# EAGLE design single_key_module (EAGLE 9.5.1)
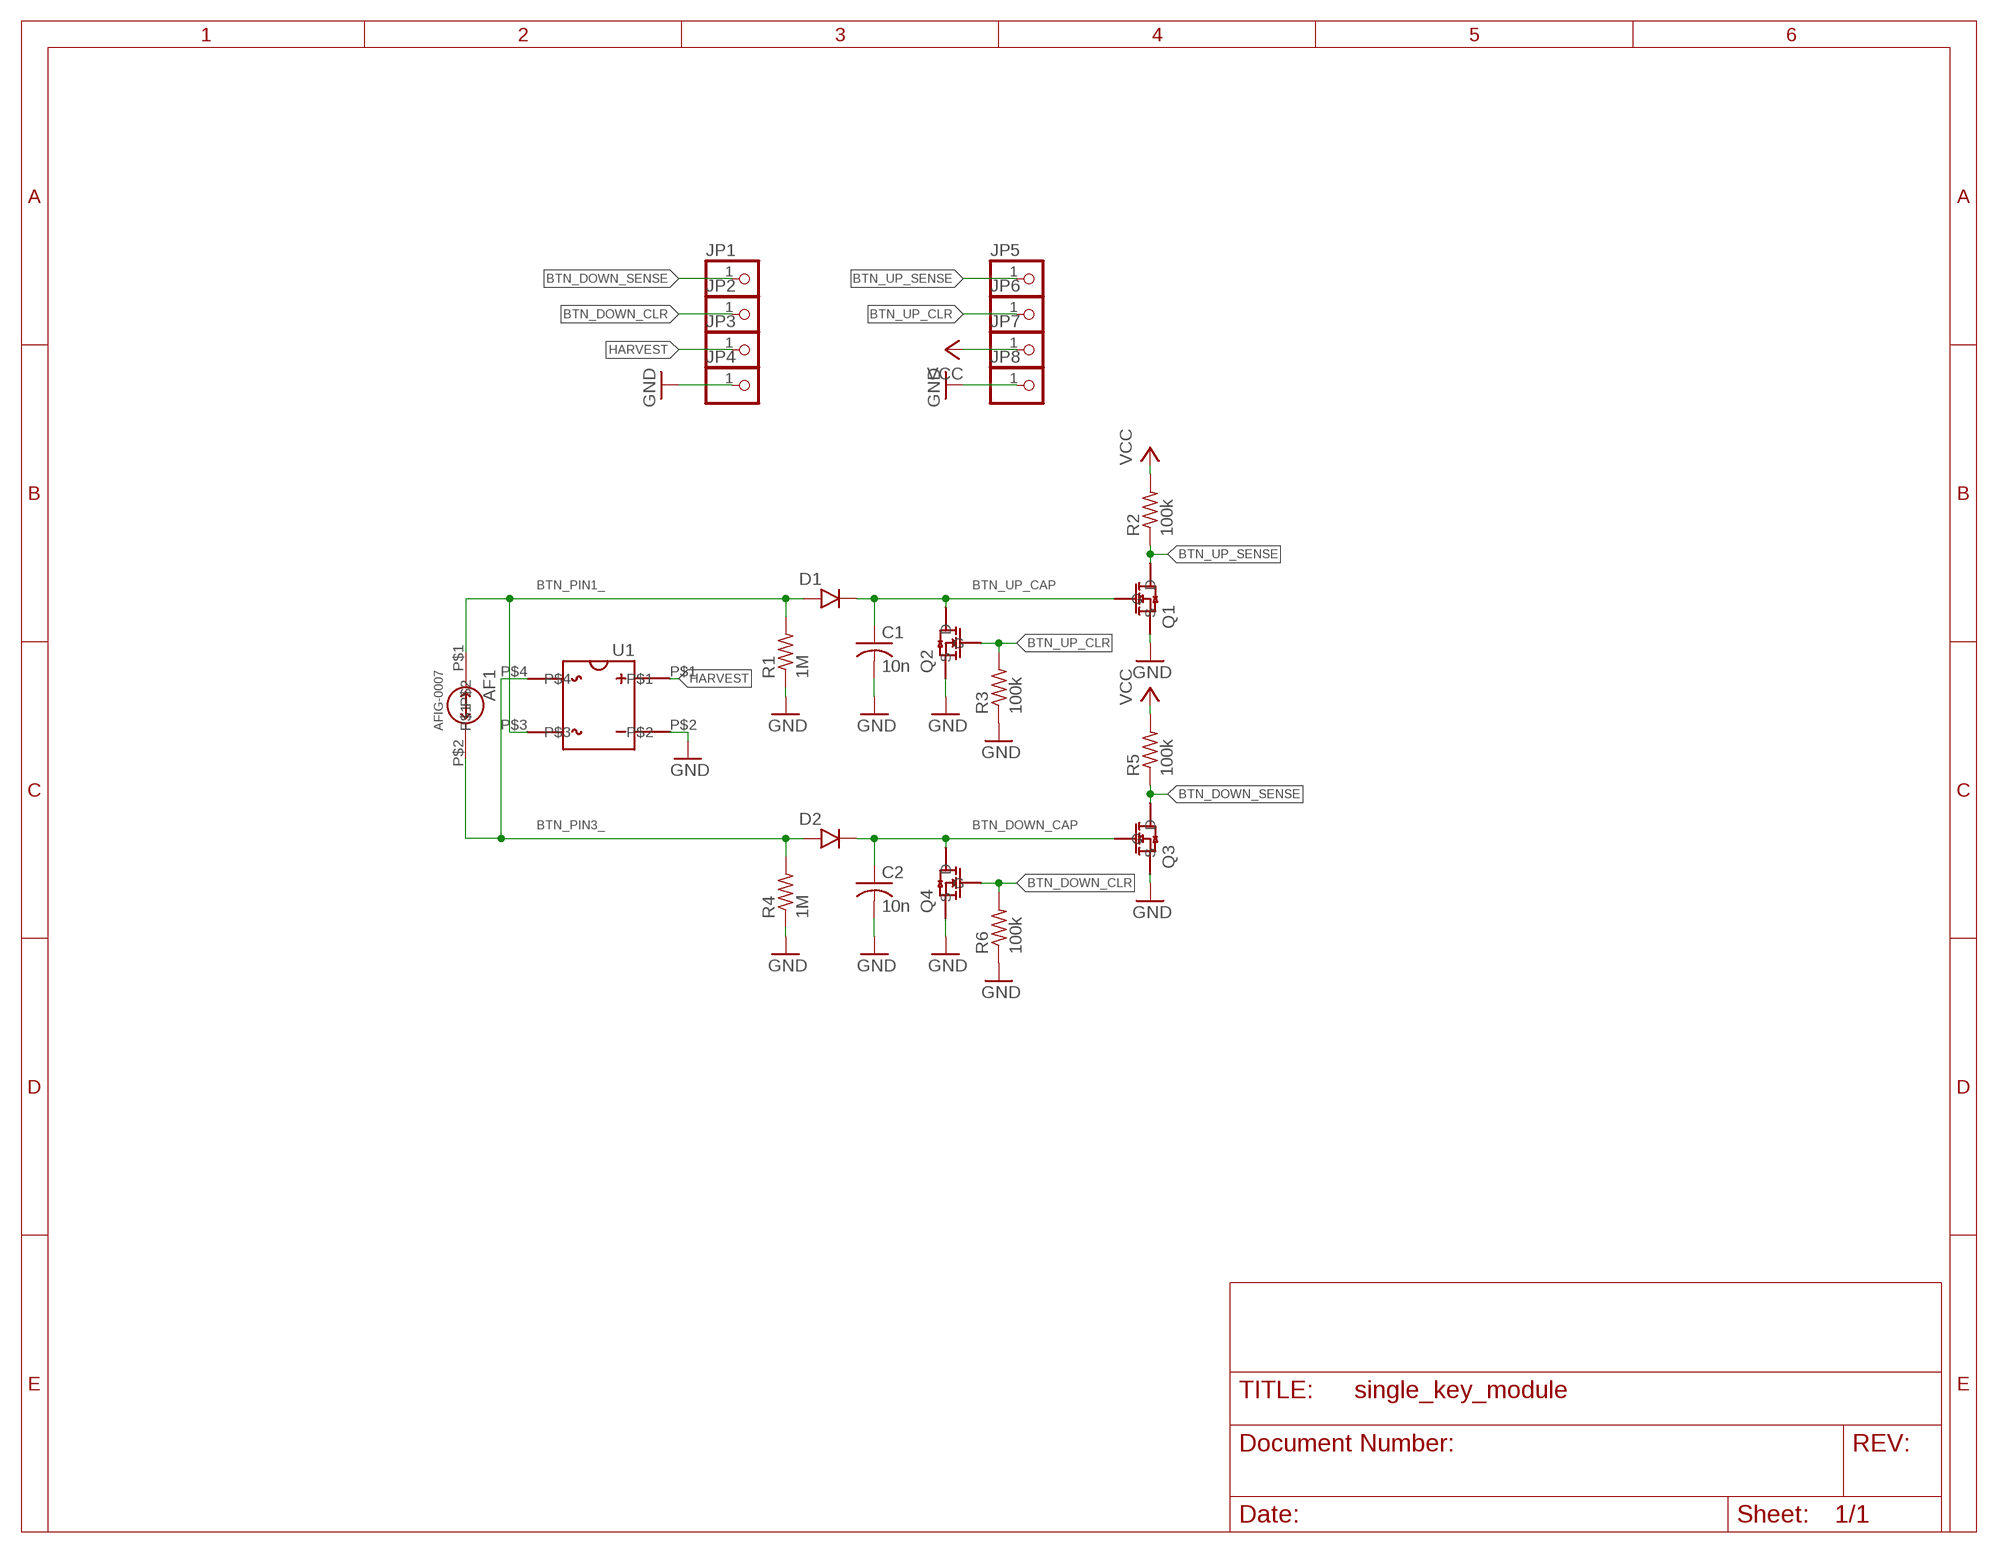
[diagram p0: schematic, sheet 1]

## Parts
AF1  BUTTON-MOUNT  [BUTTON-MOUNT]
C1  10n  C-USC0402  [C0402]
C2  10n  C-USC0402  [C0402]
D1  DFLU1200  [DFLU1200]
D2  DFLU1200  [DFLU1200]
JP1  PINHD-1X1  [1X01]
JP2  PINHD-1X1  [1X01]
JP3  PINHD-1X1  [1X01]
JP4  PINHD-1X1  [1X01]
JP5  PINHD-1X1  [1X01]
JP6  PINHD-1X1  [1X01]
JP7  PINHD-1X1  [1X01]
JP8  PINHD-1X1  [1X01]
Q1  2N7002K-7  [2N7002K-7]
Q2  BSS138K  [BSS138K]
Q3  2N7002K-7  [2N7002K-7]
Q4  BSS138K  [BSS138K]
R1  1M  R-US_R0402  [R0402]
R2  100k  R-US_R0402  [R0402]
R3  100k  R-US_R0402  [R0402]
R4  1M  R-US_R0402  [R0402]
R5  100k  R-US_R0402  [R0402]
R6  100k  R-US_R0402  [R0402]
U1  CDBHD140L-G  [CDBHDXX0L-G]

## Nets
BTN_DOWN_CAP: C2.1 D2.K Q3.G Q4.D
BTN_DOWN_CLR: JP2.1 Q4.G R6.2
BTN_DOWN_SENSE: JP1.1 Q3.D R5.1
BTN_PIN1_: AF1.P$1 D1.A R1.2 U1.P$3
BTN_PIN3_: AF1.P$2 D2.A R4.2 U1.P$4
BTN_UP_CAP: C1.1 D1.K Q1.G Q2.D
BTN_UP_CLR: JP6.1 Q2.G R3.2
BTN_UP_SENSE: JP5.1 Q1.D R2.1
GND: C1.2 C2.2 JP4.1 JP8.1 Q1.S Q2.S Q3.S Q4.S R1.1 R3.1 R4.1 R6.1 U1.P$2
HARVEST: JP3.1 U1.P$1
VCC: JP7.1 R2.2 R5.2

## Library data of the parts
AF1 = afig-0007:BUTTON-MOUNT
C1 C2 = rcl:C-US: CAPACITOR, American symbol; SPICEPREFIX: C
D1 D2 = afig-0007:DFLU1200
JP1-JP8 = pinhead:PINHD-1X1: PIN HEADER
Q1 Q3 = afig-0007:2N7002K-7
Q2 Q4 = afig-0007:BSS138K
R1-R6 = rcl:R-US_: RESISTOR, American symbol; SPICEPREFIX: R
U1 = afig-0007:CDBHD140L-G

## Board
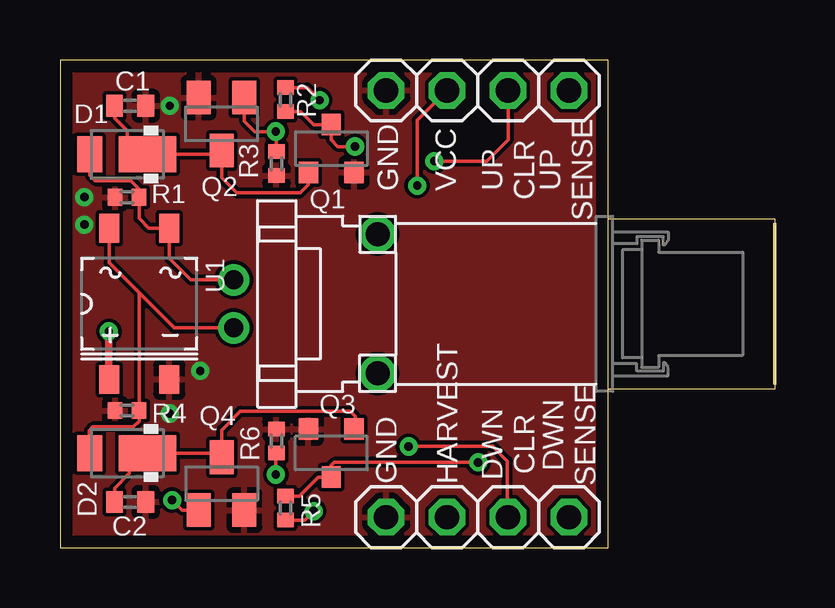
[diagram p1: board, top side]
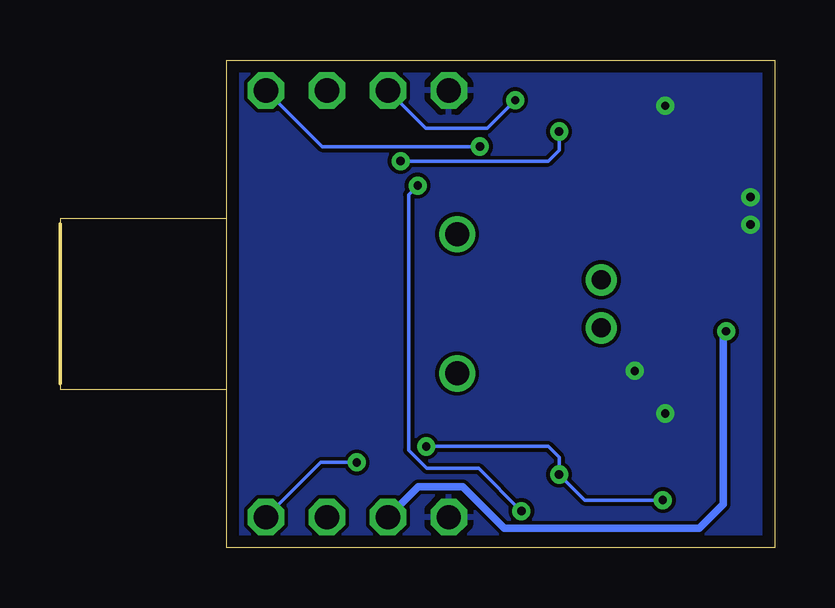
[diagram p2: board, bottom side, seen from below]

Size 22.84 x 20.32 mm. Coordinates in mm from the lower left corner, seen from the top.
Outline: 0,0 22.84,0 22.84,20.32 0,20.32 0,0
Copper layers (1*16): Top 0.035mm / dielectric 1.5mm / Bottom 0.035mm
Design rules "default *": minimum track width 6mil, minimum drill 0.35mm, track to track 6mil, track to pad 6mil, pad to pad 6mil, via to via 6mil, smd to smd 6mil, copper to edge 20mil, drill to drill 6mil, minimum pad ring 10mil, minimum via ring 8mil, stop-mask expansion 4mil, vias tented up to drill 15mil, thermal gap 10mil

### Footprints (pad centres in the part's own frame; a part is rotated, then mirrored left to right if it is on the bottom)
BUTTON-MOUNT = drill 0.8: P$1 0,1; P$2 0,-1 | drill 1: P$3 6,-2.9; P$4 6,2.9
C0402 = smd 0.7 x 0.9: 1 -0.65,0; 2 0.65,0
DFLU1200 = smd 1.05 x 1.5: A -1.55,0 | smd 2.4 x 1.5: K 0.85,0
1X01 = drill 1.016 octagon: 1 0,0
2N7002K-7 = smd 0.8 x 0.9: D 0,1; G -0.95,-1; S 0.95,-1
BSS138K = smd 1 x 1.4: D 0,1.1; G -0.95,-1.1; S 0.95,-1.1
R0402 = smd 0.6 x 0.7: 1 -0.5,0; 2 0.5,0
CDBHDXX0L-G = smd 0.85 x 1.2: P$1 1.25,3.15; P$2 -1.25,3.15; P$3 -1.25,-3.15; P$4 1.25,-3.15

### Placement (x,y rotation side)
AF1  7.24,10.16 0 top
C1  2.92,18.41 0 top
C2  2.92,1.91 0 top
D1  2.79,16.38 0 top
D2  2.79,3.94 0 top
JP1  21.21,1.27 0 top
JP2  18.67,1.27 0 top
JP3  16.13,1.27 0 top
JP4  13.59,1.27 0 top
JP5  21.21,19.05 0 top
JP6  18.67,19.05 0 top
JP7  16.13,19.05 0 top
JP8  13.59,19.05 0 top
Q1  11.3,16.64 0 top
Q2  6.73,17.65 180 top
Q3  11.3,3.94 180 top
Q4  6.73,2.67 0 top
R1  2.79,14.61 0 top
R2  9.4,18.67 90 top
R3  9.02,16 90 top
R4  2.79,5.71 0 top
R5  9.4,1.65 270 top
R6  9.02,4.45 270 top
U1  3.3,10.16 180 top

### Tracks (layer width: path | path; a pad name or v marks a point on that pad's centre or on a via)
BTN_DOWN_CAP
  Top 0.152: C2.1 2.27,2.47 2.9,3.1 2.9,3.86 2.97,3.94 D2.K 6.56,3.94 Q4.D 6.73,4.9 7.52,5.69 12.09,5.69 12.29,5.49 12.29,4.98 Q3.G
BTN_DOWN_CLR  (via drill 0.35)
  Top 0.152: JP2.1 18.64,1.29 18.64,3.61 18.03,4.22 v14.53,4.22 | v8.99,3.05 8.99,3.92 R6.2 | v4.67,1.98 5.09,1.57 Q4.G
  Bottom 0.152: v14.53,4.22 9.45,4.22 8.99,3.76 v8.99,3.05 7.92,1.98 v4.67,1.98
BTN_DOWN_SENSE  (via drill 0.35)
  Top 0.152: v17.42,3.56 11.43,3.56 11.3,3.43 Q3.D 10.76,2.94 9.97,2.15 R5.1
  Bottom 0.152: JP1.1 18.92,3.56 v17.42,3.56
BTN_PIN1_
  Top 0.152: AF1.P$1 5.45,11.16 4.55,12.06 U1.P$3 3.71,13.31 3.29,13.72 R1.2 3.29,14.94 2.95,15.29 1.47,15.29 1.24,15.52 D1.A
BTN_PIN3_
  Top 0.152: U1.P$4 2.05,11.87 3.29,10.62 | AF1.P$2 4.76,9.16 3.29,10.62 | 3.29,10.62 R4.2 3.29,5.28 3.05,5.03 1.37,5.03 1.22,4.88 1.22,3.96 D2.A
BTN_UP_CAP
  Top 0.152: Q1.G 10.35,15.13 10.01,14.78 7.37,14.78 6.73,15.42 Q2.D 6.56,16.38 D1.K 3.23,16.38 2.79,16.82 2.79,17.37 2.27,17.9 C1.1
BTN_UP_CLR  (via drill 0.35)
  Top 0.152: JP6.1 18.67,16.99 17.78,16.1 v15.6,16.1 v15.6,16.11 | R3.2 9.02,17.31 v8.99,17.34 8.11,17.34 7.68,17.77 Q2.G
  Bottom 0.152: v15.6,16.11 9.45,16.11 8.99,16.56 v8.99,17.34
BTN_UP_SENSE  (via drill 0.35)
  Top 0.152: v12.29,16.71 11.58,16.71 11.3,16.99 11.3,17.63 | 11.3,17.63 Q1.D | R2.1 10.03,18.17 10.57,17.63 11.3,17.63
  Bottom 0.152: JP5.1 18.87,16.71 v12.29,16.71
GND  (via drill 0.35)
  other vias: 1.02,14.61 1.02,13.46 4.57,18.41 5.84,7.37 4.57,5.59
  pour Top: -0.89,-1.27 24.38,-1.27 24.38,21.59 -0.89,21.59
  pour Bottom: -2.03,-2.54 25.65,-2.54 25.65,22.86 -2.03,22.86
HARVEST  (via drill 0.35)
  Top 0.305: U1.P$1 2.03,7.03 v2.03,9.02
  Bottom 0.305: JP3.1 14.86,2.54 13.01,2.54 11.28,0.81 3.15,0.81 2.16,1.8 2.16,8.89 v2.03,9.02
VCC  (via drill 0.35)
  Top 0.152: R2.2 10.29,19.17 v10.82,18.64 | JP7.1 14.88,17.8 v14.88,15.09 | R5.2 10.19,1.15 v10.57,1.52
  Bottom 0.152: JP7.1 14.55,17.47 11.99,17.47 v10.82,18.64 | v14.88,15.09 15.27,14.71 15.27,4.06 14.5,3.3 12.34,3.3 v10.57,1.52

### Text on the board
tPlace: GND | VCC | UP / CLR | UP / SENSE | HARVEST | GND | DWN / CLR | DWN / SENSE